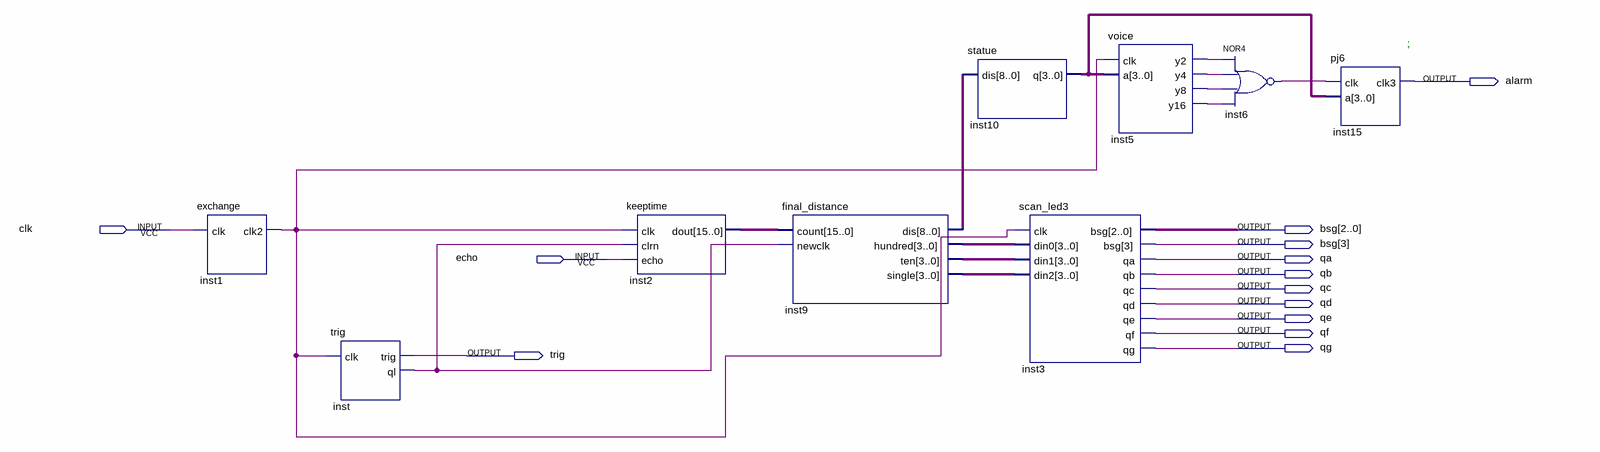
[diagram p0: schematic sheet]
// Quartus schematic final.bdf as structural Verilog: 9 symbols, 13 pins
module \final  (
  input  clk,
  input  echo,
  output alarm,
  output [3:0] bsg,
  output qa,
  output qb,
  output qc,
  output qd,
  output qe,
  output qf,
  output qg,
  output trig
);

  wire inst1_clk2, inst5_y2, inst5_y4, inst5_y8, inst5_y16, inst6_out, inst_ql;
  wire [3:0] inst9_hundred, inst9_single, inst9_ten, inst10_q;
  wire [8:0] inst9_dis;
  wire [15:0] inst2_dout;

  exchange inst1 (.clk(clk), .clk2(inst1_clk2));
  trig inst (.clk(inst1_clk2), .trig(trig), .ql(inst_ql));
  keeptime inst2 (.clk(inst1_clk2), .clrn(inst_ql), .echo(echo), .dout(inst2_dout));
  final_distance inst9 (
    .count(inst2_dout), .newclk(inst_ql), .dis(inst9_dis), .hundred(inst9_hundred), .ten(inst9_ten),
    .single(inst9_single));
  statue inst10 (.dis(inst9_dis), .q(inst10_q));
  scan_led3 inst3 (
    .clk(inst1_clk2), .din0(inst9_hundred), .din1(inst9_ten), .din2(inst9_single), .bsg(bsg), .qa(qa),
    .qb(qb), .qc(qc), .qd(qd), .qe(qe), .qf(qf), .qg(qg));
  voice inst5 (.clk(inst1_clk2), .a(inst10_q), .y2(inst5_y2), .y4(inst5_y4), .y8(inst5_y8), .y16(inst5_y16));
  nor inst6 (inst6_out, inst5_y2, inst5_y4, inst5_y8, inst5_y16);
  pj6 inst15 (.clk(inst6_out), .a(inst10_q), .clk3(alarm));

  // Notes on the sheet:
  //   ;
endmodule
